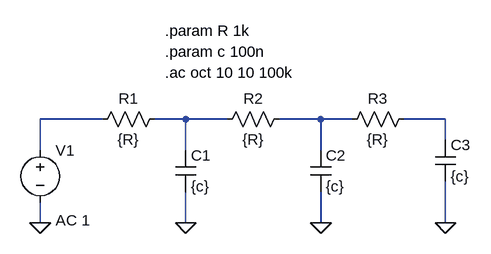
[diagram p0: schematic param command.asc]
param command.asc, the LTspice schematic file:
Version 4.1
SHEET 1 880 680
WIRE 64 128 -32 128
WIRE 192 128 144 128
WIRE 256 128 192 128
WIRE 400 128 336 128
WIRE 448 128 400 128
WIRE 592 128 528 128
WIRE 592 160 592 128
WIRE -32 176 -32 128
WIRE 192 176 192 128
WIRE 400 176 400 128
WIRE -32 288 -32 256
WIRE 192 288 192 240
WIRE 400 288 400 240
WIRE 592 288 592 224
FLAG 592 288 0
FLAG 400 288 0
FLAG 192 288 0
FLAG -32 288 0
SYMBOL voltage -32 160 R0
WINDOW 123 24 124 Left 2
WINDOW 39 0 0 Left 0
SYMATTR InstName V1
SYMATTR Value ""
SYMATTR Value2 AC 1
SYMBOL res 160 112 R90
WINDOW 0 0 56 VBottom 2
WINDOW 3 32 56 VTop 2
SYMATTR InstName R1
SYMATTR Value {R}
SYMBOL res 352 112 R90
WINDOW 0 0 56 VBottom 2
WINDOW 3 32 56 VTop 2
SYMATTR InstName R2
SYMATTR Value {R}
SYMBOL res 544 112 R90
WINDOW 0 0 56 VBottom 2
WINDOW 3 32 56 VTop 2
SYMATTR InstName R3
SYMATTR Value {R}
SYMBOL cap 176 176 R0
SYMATTR InstName C1
SYMATTR Value {c}
SYMBOL cap 384 176 R0
SYMATTR InstName C2
SYMATTR Value {c}
SYMBOL cap 576 160 R0
SYMATTR InstName C3
SYMATTR Value {c}
TEXT 160 -8 Left 2 !.param R 1k
TEXT 160 24 Left 2 !.param c 100n
TEXT 160 56 Left 2 !.ac oct 10 10 100k

The netlist it stands for:
* param command.asc
V1 N001 0 AC 1
R1 N002 N001 {R}
R2 N003 N002 {R}
R3 N004 N003 {R}
C1 N002 0 {c}
C2 N003 0 {c}
C3 N004 0 {c}
.param R 1k
.param c 100n
.ac oct 10 10 100k
.backanno
.end